# Altium project capacitivesensor.PrjPcb
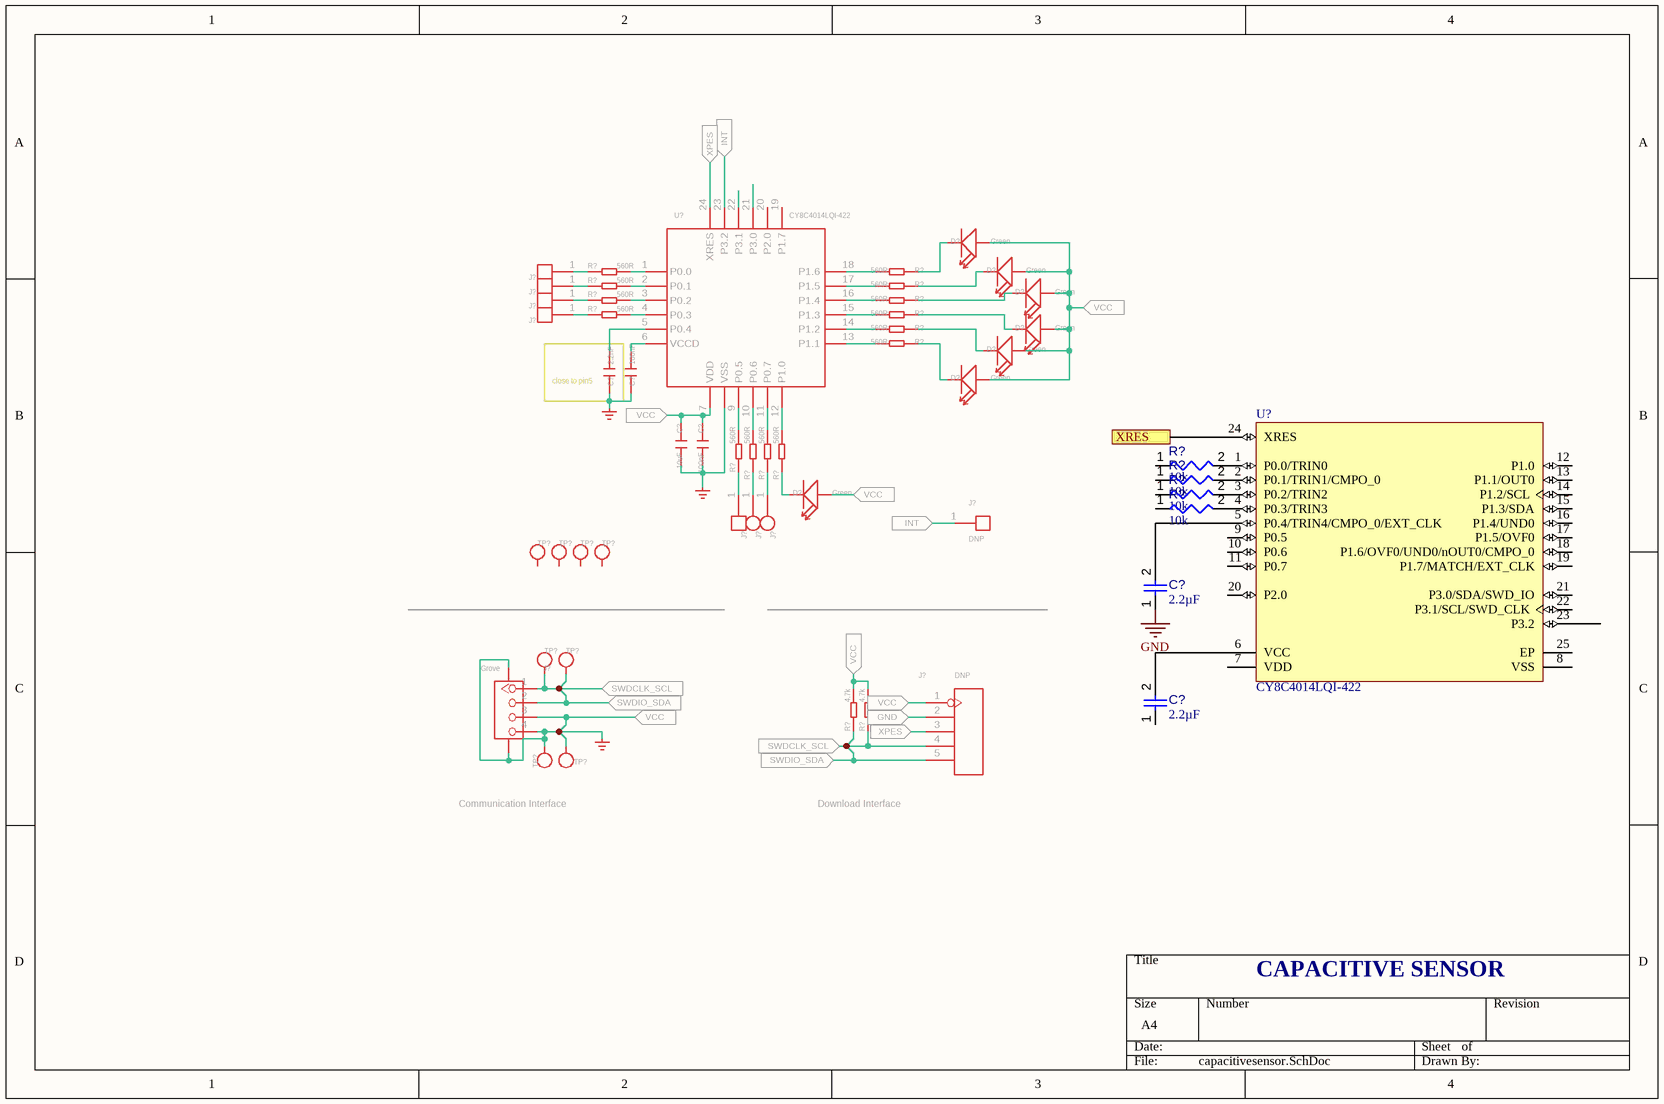
[diagram p0: capacitivesensor.SchDoc]
2 sheets, 56 parts. Net scope: flat (ports and power ports of the same name join across sheets).
Board file: capacitivesensor.PcbDoc
Sheets:
  capacitivesensor.SchDoc
  Sheet1.SchDoc

## Sheet capacitivesensor.SchDoc
size A4

### Parts
(Parts that share a designator on the sheet are numbered #1, #2 ... from top to bottom, then left to right.)
C?#1  2.2nF  [C0603]
C?#2  100nF  [C0603]
C?#3  10uF  [C0603]
C?#4  100nF  [C0603]
C?#5  value 2.2µF  [CAPC0402(1005)60_L]  (hidden comment: Capacitor 2,2µF +/-20% 10V 0402)
C?#6  value 2.2µF  [CAPC0402(1005)60_L]  (hidden comment: Capacitor 2,2µF +/-20% 10V 0402)
D?#1  Green  [LED-0603]
D?#2  Green  [LED-0603]
D?#3  Green  [LED-0603]
D?#4  Green  [LED-0603]
D?#5  Green  [LED-0603]
D?#6  Green  [LED-0603]
D?#7  Green  [LED-0603]
J?#1  PAD-SLIDE-1P  [PAD-SLIDE-1P]  (value not drawn)
J?#2  PAD-SLIDE-1P  [PAD-SLIDE-1P]  (value not drawn)
J?#3  PAD-SLIDE-1P  [PAD-SLIDE-1P]  (value not drawn)
J?#4  PAD-SLIDE-1P  [PAD-SLIDE-1P]  (value not drawn)
J?#5  PAD-SLIDE-1P  [PAD-SLIDE-1P]  (value not drawn)
J?#6  PAD-SWITCH-1P  [PAD-SWITCH-1P]  (value not drawn)
J?#7  PAD-SWITCH-1P  [PAD-SWITCH-1P]  (value not drawn)
J?#8  DNP  [1P-65/35MIL]
J?#9  Grove  [HW4-SMD-2.0-90D]
J?#10  DNP  [H5-SMD-2.0-TEST]
R?#1  560R  [R0603]
R?#2  560R  [R0603]
R?#3  560R  [R0603]
R?#4  560R  [R0603]
R?#5  560R  [R0603]
R?#6  560R  [R0603]
R?#7  560R  [R0603]
R?#8  560R  [R0603]
R?#9  560R  [R0603]
R?#10  560R  [R0603]
R?#11  560R  [R0603]
R?#12  560R  [R0603]
R?#13  560R  [R0603]
R?#14  560R  [R0603]
R?#15  value 10k  [RESC1608X55X25ML10T15]  (hidden comment: Resistor 10k +/-1% 0603 100 mW)
R?#16  value 10k  [RESC1608X55X25ML10T15]  (hidden comment: Resistor 10k +/-1% 0603 100 mW)
R?#17  value 10k  [RESC1608X55X25ML10T15]  (hidden comment: Resistor 10k +/-1% 0603 100 mW)
R?#18  value 10k  [RESC1608X55X25ML10T15]  (hidden comment: Resistor 10k +/-1% 0603 100 mW)
R?#19  4.7k  [R0603]
R?#20  4.7k  [R0603]
TP?#1  TEST-POINT'4545'  [TP-D45MIL]  (value not drawn)
TP?#2  TEST-POINT'4545'  [TP-D45MIL]  (value not drawn)
TP?#3  TEST-POINT'4545'  [TP-D45MIL]  (value not drawn)
TP?#4  TEST-POINT'4545'  [TP-D45MIL]  (value not drawn)
TP?#5  TEST-POINT'4545'  [TP-D45MIL]  (value not drawn)
TP?#6  TEST-POINT'4545'  [TP-D45MIL]  (value not drawn)
TP?#7  TEST-POINT'4545'  [TP-D45MIL]  (value not drawn)
TP?#8  TEST-POINT'4545'  [TP-D45MIL]  (value not drawn)
U$?#1  GND_POWER  (value not drawn)
U$?#2  GND_POWER  (value not drawn)
U$?#3  GND_POWER  (value not drawn)
U?#1  CY8C4014LQI-422  [QFN24G-0.5-4X4MM]
U?#2  CY8C4014LQI-422  [CYP-LQ24_M]

### Blocks framed on the sheet
close to pin5: C?#1

### Ports
GND (in), INT (in), SWDCLK_SCL (in), SWDIO_SDA (in), VCC (in), XPES (in), XRES

### Nets
GND: C?#5.1
NetC?#1_1: C?#1.1 C?#2.1 U$?#1.?1(GND)
NetC?#1_2: C?#1.2 U?#1.5(P0.4)
NetC?#2_2: C?#2.2 U?#1.6(VCCD)
NetC?#3_1: C?#3.1 C?#4.1 D?#1.+ D?#2.+ D?#3.+ D?#4.+ D?#5.+ D?#6.+ D?#7.+ J?#9.3 J?#9.4 J?#9.SS1 J?#9.SS2 J?#10.1 R?#19.2 R?#20.2 TP?#7.T TP?#8.T U$?#3.?1(GND) U?#1.7(VDD) ; port VCC
NetC?#3_2: C?#3.2 C?#4.2 U$?#2.?1(GND) U?#1.8_PAD(VSS)
NetD?#1_-: D?#1.- R?#2.1
NetD?#2_-: D?#2.- R?#4.1
NetD?#3_-: D?#3.- R?#6.1
NetD?#4_-: D?#4.- R?#8.1
NetD?#5_-: D?#5.- R?#9.1
NetD?#6_-: D?#6.- R?#10.1
NetD?#7_-: D?#7.- R?#14.1
NetJ?#1_1: J?#1.1 R?#1.1
NetJ?#2_1: J?#2.1 R?#3.1
NetJ?#3_1: J?#3.1 R?#5.1
NetJ?#4_1: J?#4.1 R?#7.1
NetJ?#5_1: J?#5.1 R?#11.1
NetJ?#6_1: J?#6.1 R?#12.1
NetJ?#7_1: J?#7.1 R?#13.1
NetJ?#8_1: J?#8.1 U?#1.23(P3.2) ; port INT
NetJ?#9_1: J?#9.1 J?#9.2 J?#10.4 J?#10.5 R?#19.1 R?#20.1 TP?#5.T TP?#6.T ; port SWDCLK_SCL, port SWDIO_SDA
NetJ?#10_2: J?#10.2 ; port GND
NetJ?#10_3: J?#10.3 U?#1.24(XRES) ; port XPES
NetR?#1_2: R?#1.2 U?#1.1(P0.0)
NetR?#2_2: R?#2.2 U?#1.18(P1.6)
NetR?#3_2: R?#3.2 U?#1.2(P0.1)
NetR?#4_2: R?#4.2 U?#1.17(P1.5)
NetR?#5_2: R?#5.2 U?#1.3(P0.2)
NetR?#6_2: R?#6.2 U?#1.16(P1.4)
NetR?#7_2: R?#7.2 U?#1.4(P0.3)
NetR?#8_2: R?#8.2 U?#1.15(P1.3)
NetR?#9_2: R?#9.2 U?#1.14(P1.2)
NetR?#10_2: R?#10.2 U?#1.13(P1.1)
NetR?#11_2: R?#11.2 U?#1.9(P0.5)
NetR?#12_2: R?#12.2 U?#1.10(P0.6)
NetR?#13_2: R?#13.2 U?#1.11(P0.7)
NetR?#14_2: R?#14.2 U?#1.12(P1.0)
NetR?#15_2: R?#15.2 U?#2.1(P0.0/TRIN0)
NetR?#16_2: R?#16.2 U?#2.2(P0.1/TRIN1/CMPO_0)
NetR?#17_2: R?#17.2 U?#2.3(P0.2/TRIN2)
NetR?#18_2: R?#18.2 U?#2.4(P0.3/TRIN3)

Not connected (* = marked no-connect by the designer): C?#5 2; C?#6 1 2; R?#15 1; R?#16 1; R?#17 1; R?#18 1; TP?#1 T; TP?#2 T; TP?#3 T; TP?#4 T; U?#1 19(P1.7) 20(P2.0) 21(P3.0) 22(P3.1); U?#2 5(P0.4/TRIN4/CMPO_0/EXT_CLK) 6(VCC) 7(VDD) 8(VSS) 9(P0.5) 10(P0.6) 11(P0.7) 12(P1.0) 13(P1.1/OUT0) 14(P1.2/SCL) 15(P1.3/SDA) 16(P1.4/UND0) 17(P1.5/OVF0) 18(P1.6/OVF0/UND0/nOUT0/CMPO_0) 19(P1.7/MATCH/EXT_CLK) 20(P2.0) 21(P3.0/SDA/SWD_IO) 22(P3.1/SCL/SWD_CLK) 23(P3.2) 24(XRES) 25(EP)

### Notes on the sheet
- (near TP?#8) Communication Interface
- Download Interface
- CAPACITIVE SENSOR

### Library data of the parts
C?#1-C?#4 = CAP-0603: Ceramic Capacitors; GateName_1: C; DeviceName: -0603; DeviceSetName: CAP; SymbolName_1: C; LibraryName: Discrete-new
C?#5 C?#6 = CMP-001-00056-3: Chip Capacitor, 2,2µF +/-20%, 10V, 0402, Thickness 0.6 mm; Tolerance: 10%; Voltage Rating: 10V; Case/Package: 0402; Max Operating Temperature: 85°C; Pins: 2; Min Operating Temperature: -55°C; Mounting Technology: SMT
D?#1-D?#7 = LED'0603': GateName_1: LED; DeviceName: '0603'; SymbolName_1: LED; LibraryName: Discrete-new; DeviceSetName: LED
J?#1-J?#5 = PAD-SLIDE-1P: GateName_1: G$1; SymbolName_1: PAD-SLIDE-1P; LibraryName: Connector-new; DeviceSetName: PAD-SLIDE-1P
J?#6 J?#7 = PAD-SWITCH-1P: SWITCH PAD; GateName_1: G$1; SymbolName_1: PAD-SWITCH-1P; LibraryName: Connector-new; DeviceSetName: PAD-SWITCH-1P
J?#8 = HEADER-1P-35: GateName_1: G$1; DeviceName: -35; SymbolName_1: HEADER-1P; LibraryName: Connector-new; DeviceSetName: HEADER-1P
J?#9 = GROVE-CONNECTOR-SMD'90D': 4P-SMD-2.0:320110030;4P-SMD-2.0-90D:320110032; GateName_1: G$1; DeviceName: '90D'; SymbolName_1: GROVE-CONNECTOR-SMD; LibraryName: Connector-new; DeviceSetName: GROVE-CONNECTOR-SMD
J?#10 = HEADER-5P-TEST: GateName_1: G$1; DeviceName: -TEST; SymbolName_1: HEADER-5P; LibraryName: Connector-new; DeviceSetName: HEADER-5P
R?#1-R?#14 R?#19 R?#20 = RES-0603: GateName_1: R; SymbolName_1: RES-ARRAY; DeviceName: -0603; DeviceSetName: RES; LibraryName: Discrete-new
R?#15-R?#18 = CMP-009-00017-4: Chip Resistor, 10 KOhm, +/- 1%, 01 W, -55 to 155 degC, 0603 (1608 Metric); Voltage Rating: 50V; Power: 100mW; Min Operating Temperature: -55°C; Tolerance: 1%; Case/Package: 0603; Pins: 2; Max Operating Temperature: 155°C; RoHS Compliant: True; Mounting Technology: SM
TP?#1-TP?#8 = TEST-POINT'4545': PARTNO: DNP; GateName_1: TP; DeviceName: '4545'; SymbolName_1: TEST-POINT; LibraryName: Discrete-new; DeviceSetName: TEST-POINT
U$?#1-U$?#3 = GND_POWER: GateName_1: G$1; SymbolName_1: GND_POWER; LibraryName: Power or GND; DeviceSetName: GND_POWER
U?#1 = MCU-PSOC-4000: GateName_1: G$1; SymbolName_1: MCU-PSOC-4000; LibraryName: IC2-new; DeviceSetName: MCU-PSOC-4000
U?#2 = CMP-1562-00030-1: Programmable System-on-Chip (PSoC®), 16 KB Flash, 20 GPIOs, 1.71 to 5.5 V, 24-Pin QFN (LQ24), Tray; Manufacturer: Cypress; Max. Operating Voltage (V): 5.5; Flash (KB): 16; CPU Core: ARM Cortex-M0; No. of GPIOs: 20; Min. Operating Voltage (V): 1.71; SRAM (KB): 2; ComponentLink3URL: http://www.cypress.com/file/116676/download; ComponentLink3Description: Package Specification; ComponentLink2Description: Datasheet; PartNumber: CY8C4014LQI-422; Code_JEDEC: MO-248; ComponentLink2URL: http://www.cypress.com/file/138646/download; Mounting Technology: Surface Mount; ComponentLink1URL: http://www.cypress.com/; PackageReference: LQ24; PackageVersion: Rev. *E, 07/2012; Max. Operating Frequency (MHz): 16; Max. Operating Temp. (degreesC): 85; PackageDescription: 24-Pin Quad Flat No Lead, Body 4 x 4 mm, Pitch 0.5 mm; Packing: Tray; DatasheetVersion: Rev. *E; Min. Operating Temp. (degreesC): -40; ComponentLink1Description: Manufacturer URL; RoHS: Pb-Free

## Sheet Sheet1.SchDoc
size A4